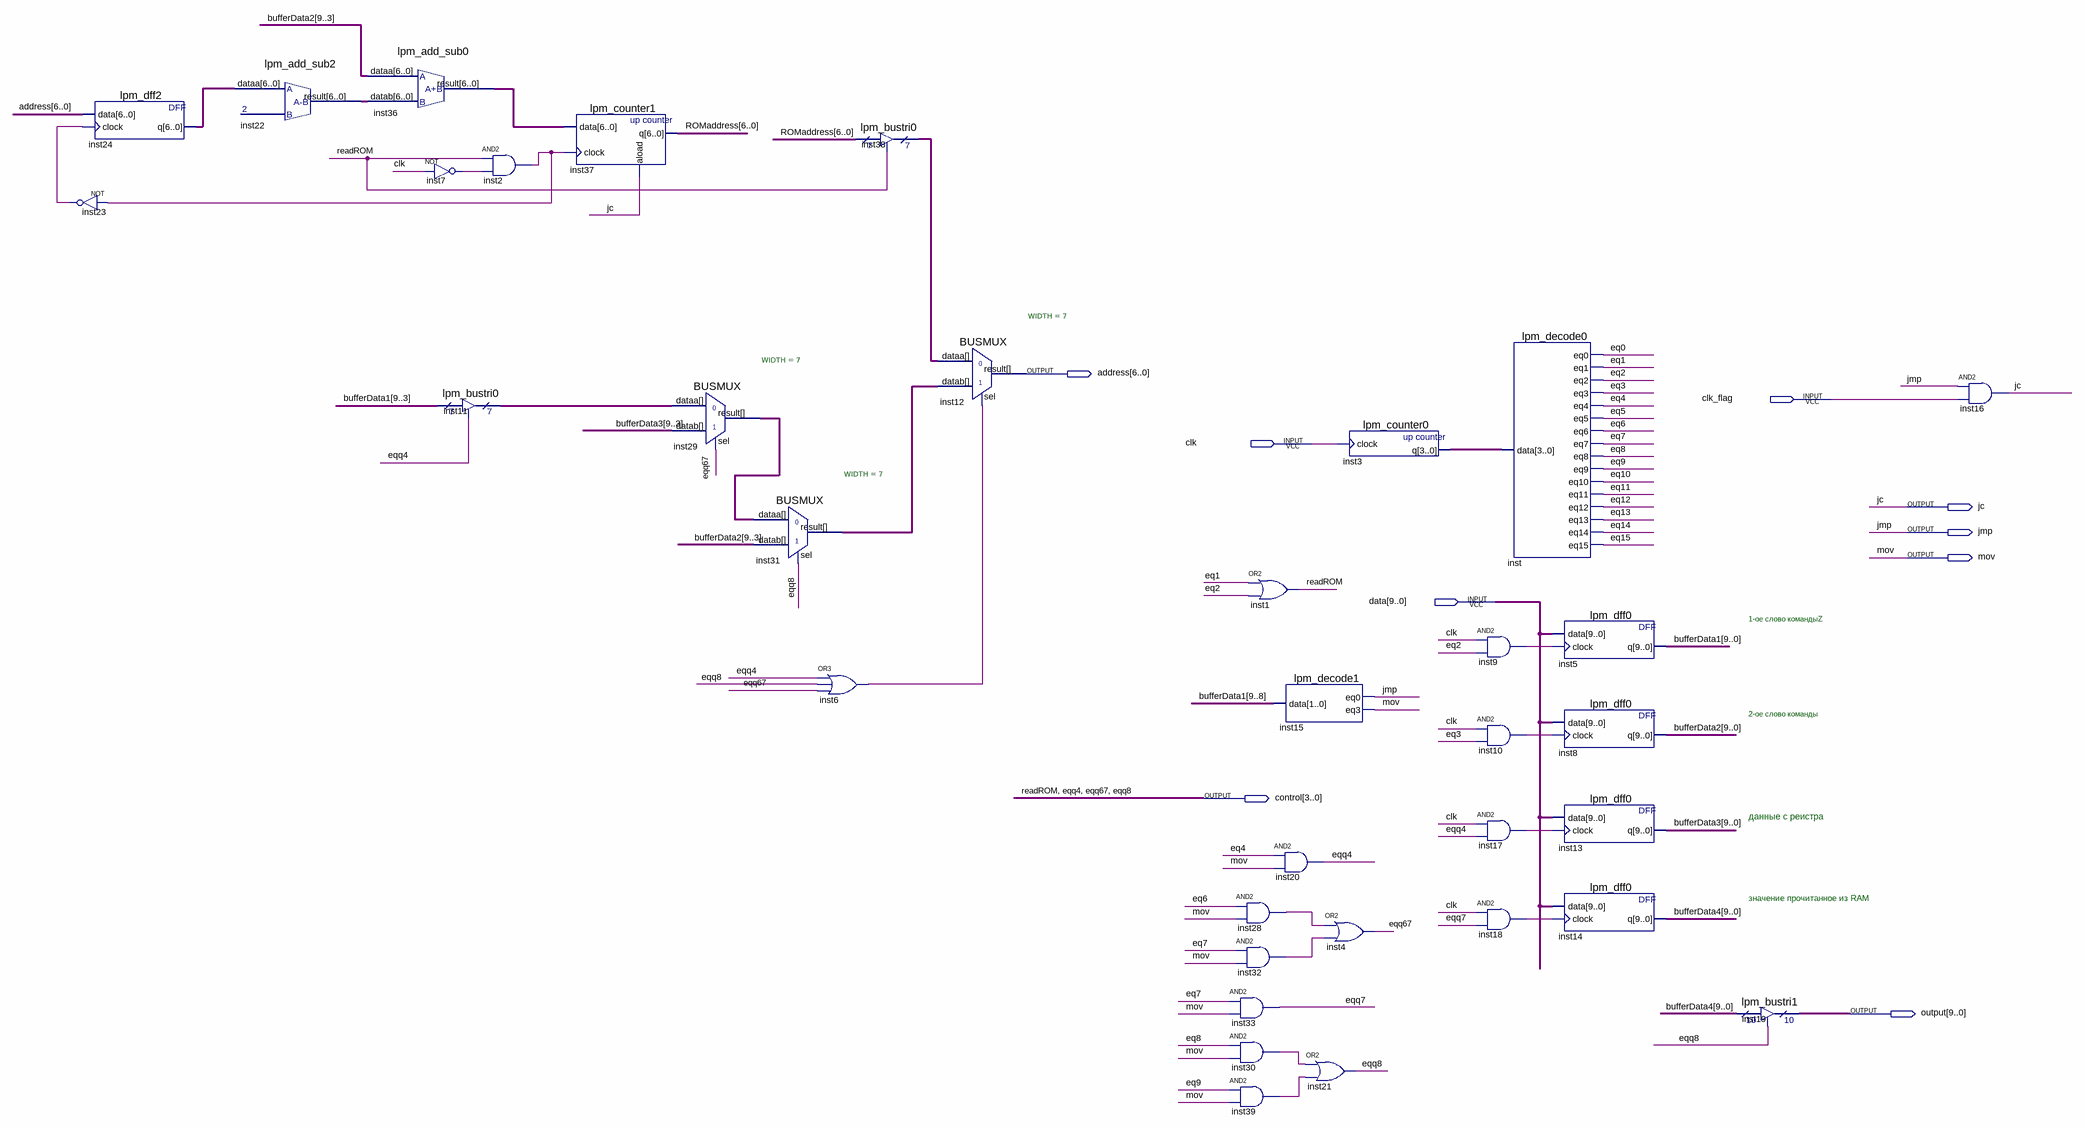
[diagram p0: schematic sheet]
// Quartus schematic device_control.bdf as structural Verilog: 35 symbols, 9 pins
module device_control (
  input  clk_flag,
  input  clk,
  input  [9:0] data,
  output [6:0] address,
  output jc,
  output jmp,
  output mov,
  output [3:0] control,
  output [9:0] \output 
);

  wire eq0, eq1, eq2, eq3, eq4, eq5, eq6, eq7, eq8, eq9, eq10, eq11, eq12, eq13, eq14, eq15, eqq7, inst2_out,
       inst6_out, inst7_out, inst9_out, inst10_out, inst17_out, inst18_out, inst23_out, inst28_out,
       inst30_out, inst32_out, inst39_out;
  wire [3:0] inst3_q;
  wire [6:0] inst11_tridata, inst22_result, inst24_q, inst29_result, inst31_result, inst36_result,
       inst38_tridata, ROMaddress;
  wire [9:0] bufferData1, bufferData2, bufferData3, bufferData4;

  lpm_dff2 inst24 (.data(address), .clock(inst23_out), .q(inst24_q));
  not inst23 (inst23_out, inst2_out);
  lpm_add_sub2 inst22 (.dataa(inst24_q), .result(inst22_result));
  lpm_add_sub0 inst36 (.dataa(bufferData2[9:3]), .datab(inst22_result), .result(inst36_result));
  not inst7 (inst7_out, clk);
  lpm_bustri0 inst11 (.enabledt(control[2]), .data(bufferData1[9:3]), .tridata(inst11_tridata));
  and inst2 (inst2_out, control[3], inst7_out);
  lpm_counter1 inst37 (.data(inst36_result), .clock(inst2_out), .aload(jc), .q(ROMaddress));
  BUSMUX #(.WIDTH(7)) inst29 (
    .datab(bufferData3[9:3]), .sel(control[1]), .dataa(inst11_tridata), .result(inst29_result));
  BUSMUX #(.WIDTH(7)) inst31 (
    .datab(bufferData2[9:3]), .sel(control[0]), .dataa(inst29_result), .result(inst31_result));
  or inst6 (inst6_out, control[2], control[0], control[1]);
  lpm_bustri0 inst38 (.enabledt(control[3]), .data(ROMaddress), .tridata(inst38_tridata));
  BUSMUX #(.WIDTH(7)) inst12 (.datab(inst31_result), .sel(inst6_out), .dataa(inst38_tridata), .result(address));
  or inst1 (control[3], eq1, eq2);
  and inst28 (inst28_out, eq6, mov);
  and inst32 (inst32_out, eq7, mov);
  and inst33 (eqq7, eq7, mov);
  and inst30 (inst30_out, eq8, mov);
  and inst39 (inst39_out, eq9, mov);
  lpm_decode1 inst15 (.data(bufferData1[9:8]), .eq0(jmp), .eq3(mov));
  and inst20 (control[2], eq4, mov);
  or inst21 (control[0], inst30_out, inst39_out);
  lpm_counter0 inst3 (.clock(clk), .q(inst3_q));
  or inst4 (control[1], inst28_out, inst32_out);
  lpm_decode0 inst (
    .data(inst3_q), .eq0(eq0), .eq1(eq1), .eq2(eq2), .eq3(eq3), .eq4(eq4), .eq5(eq5), .eq6(eq6), .eq7(eq7),
    .eq8(eq8), .eq9(eq9), .eq10(eq10), .eq11(eq11), .eq12(eq12), .eq13(eq13), .eq14(eq14), .eq15(eq15));
  and inst9 (inst9_out, clk, eq2);
  and inst10 (inst10_out, clk, eq3);
  and inst17 (inst17_out, clk, control[2]);
  and inst18 (inst18_out, clk, eqq7);
  lpm_dff0 inst5 (.data(data), .clock(inst9_out), .q(bufferData1));
  lpm_dff0 inst8 (.data(data), .clock(inst10_out), .q(bufferData2));
  lpm_dff0 inst13 (.data(data), .clock(inst17_out), .q(bufferData3));
  lpm_dff0 inst14 (.data(data), .clock(inst18_out), .q(bufferData4));
  lpm_bustri1 inst19 (.enabledt(control[0]), .data(bufferData4), .tridata(\output ));
  and inst16 (jc, jmp, clk_flag);

  // Other names for the same wires on the sheet: eqq4 = control[2]; eqq8 = control[0]; eqq67 = control[1];
  //   readROM = control[3]

  // Notes on the sheet:
  //   1-ое слово командыZ
  //   2-ое слово команды
  //   данные с реистра
  //   значение прочитанное из RAM
endmodule
